# EAGLE board iotester (EAGLE 6.6.0)
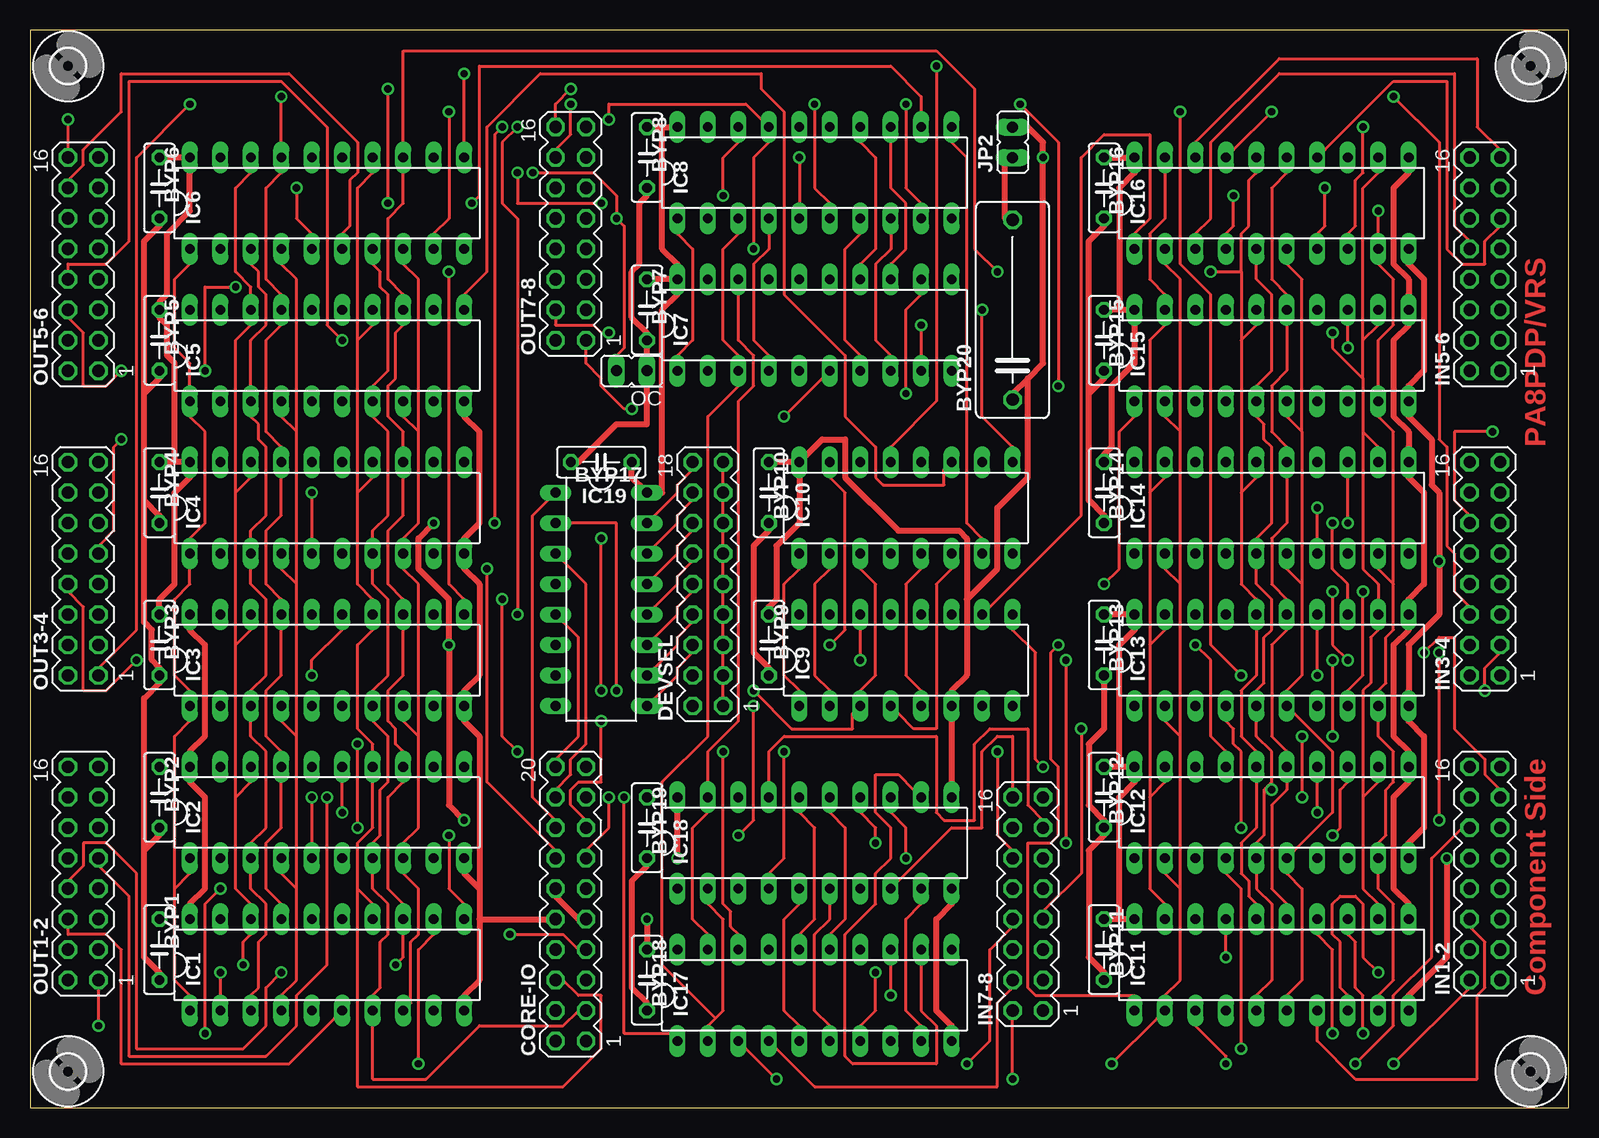
[diagram p2: board, top side]
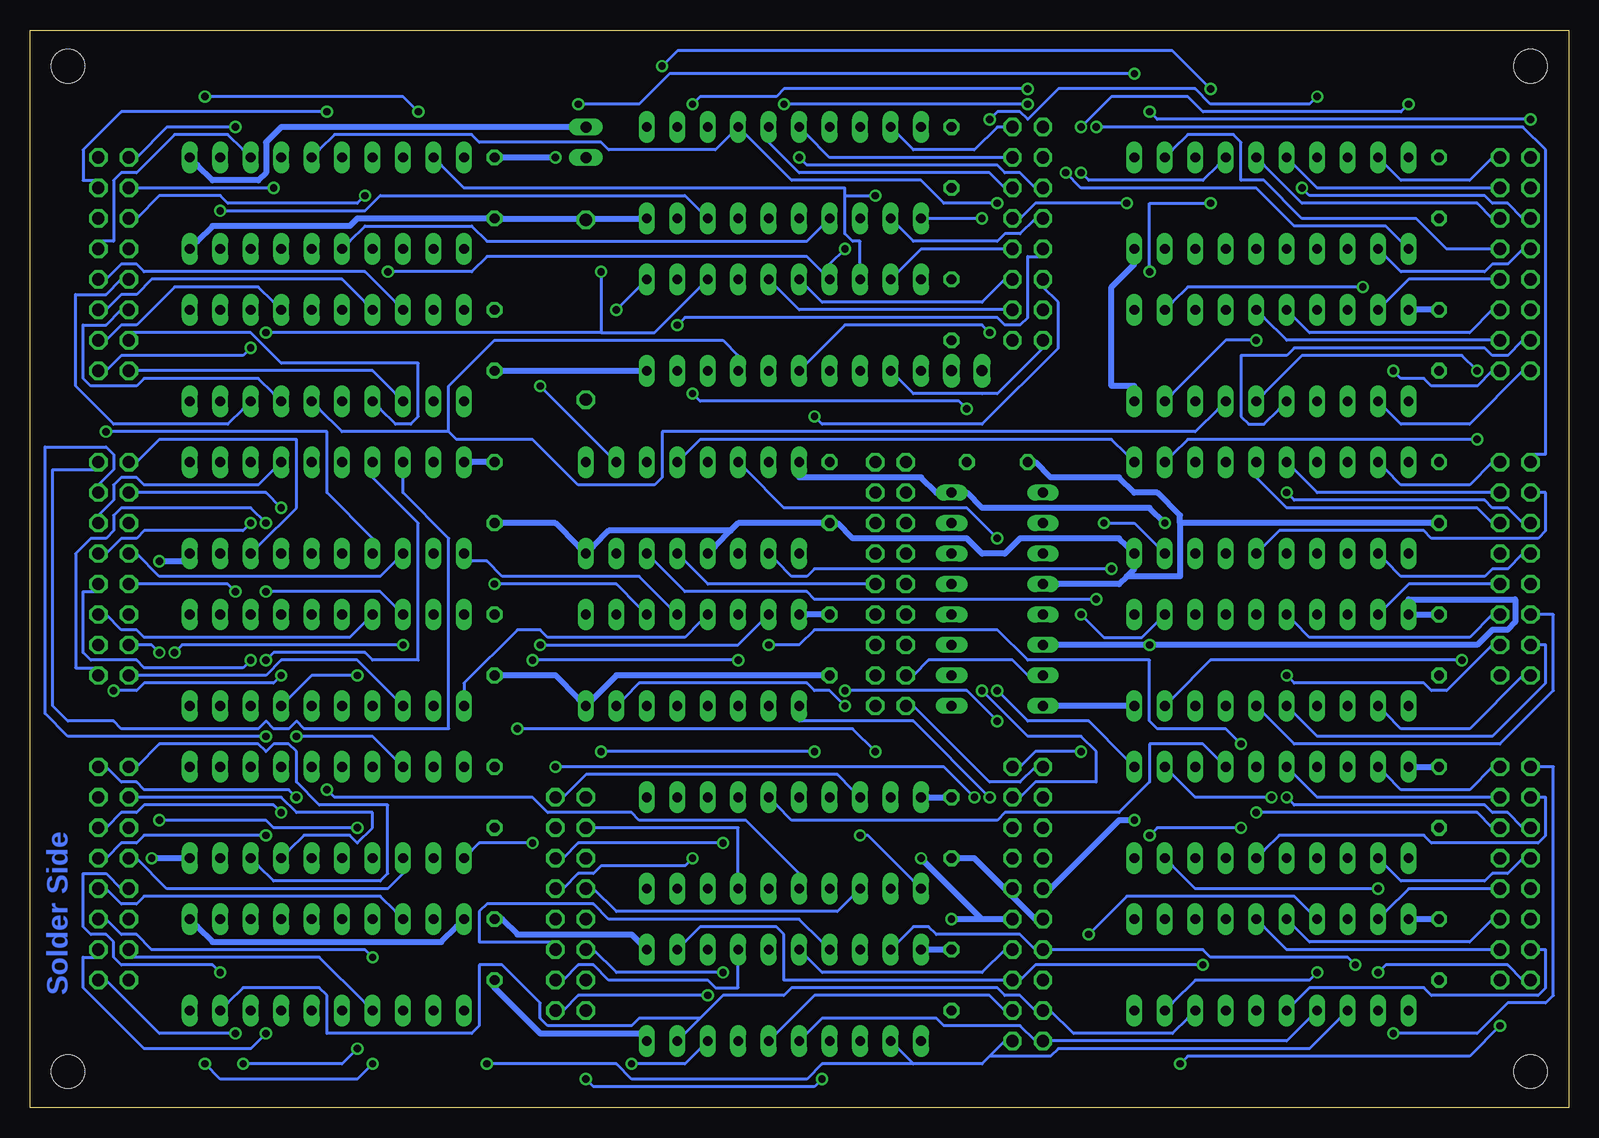
[diagram p3: board, bottom side, seen from below]

Size 128.25 x 89.84 mm. Coordinates in mm from the lower left corner, seen from the top.
Outline: 0,0 128.25,0 128.25,89.84 0,89.84 0,0
Copper layers (1*16): Top 0.035mm / dielectric 1.5mm / Bottom 0.035mm
Design rules "olimex10mil": minimum track width 10mil, minimum drill 24mil, track to track 10mil, track to pad 10mil, pad to pad 10mil, via to via 10mil, smd to smd 10mil, copper to edge 40mil, drill to drill 10mil, minimum pad ring 10mil, minimum via ring 8mil, stop-mask expansion 0mil, vias tented up to drill 0mil, thermal gap 10mil
Net classes: 1 Power: width 0.508 mm, drill 0.254 mm, clearance 0.254 mm

## Footprints (pad centres in the part's own frame; a part is rotated, then mirrored left to right if it is on the bottom)
JP1 = drill 0.914 long: 1 0,-1.27; 2 0,1.27
C050-025X075 = drill 0.813 octagon: 1 -2.54,0; 2 2.54,0
C150-064X183 = drill 1.016 octagon: 1 -7.493,0; 2 7.493,0
MA10-2 = drill 1.016 octagon: 1 -11.43,-1.27; 2 -11.43,1.27; 3 -8.89,-1.27; 4 -8.89,1.27; 5 -6.35,-1.27; 6 -6.35,1.27; 7 -3.81,-1.27; 8 -3.81,1.27; 9 -1.27,-1.27; 10 -1.27,1.27; 11 1.27,-1.27; 12 1.27,1.27; 13 3.81,-1.27; 14 3.81,1.27; 15 6.35,-1.27; 16 6.35,1.27; 17 8.89,-1.27; 18 8.89,1.27; 19 11.43,-1.27; 20 11.43,1.27
MA09-2 = drill 1.016 octagon: 1 -10.16,-1.27; 2 -10.16,1.27; 3 -7.62,-1.27; 4 -7.62,1.27; 5 -5.08,-1.27; 6 -5.08,1.27; 7 -2.54,-1.27; 8 -2.54,1.27; 9 0,-1.27; 10 0,1.27; 11 2.54,-1.27; 12 2.54,1.27; 13 5.08,-1.27; 14 5.08,1.27; 15 7.62,-1.27; 16 7.62,1.27; 17 10.16,-1.27; 18 10.16,1.27
DIL20 = drill 0.813 long: 1 -11.43,-3.81; 2 -8.89,-3.81; 3 -6.35,-3.81; 4 -3.81,-3.81; 5 -1.27,-3.81; 6 1.27,-3.81; 7 3.81,-3.81; 8 6.35,-3.81; 9 8.89,-3.81; 10 11.43,-3.81; 11 11.43,3.81; 12 8.89,3.81; 13 6.35,3.81; 14 3.81,3.81; 15 1.27,3.81; 16 -1.27,3.81; 17 -3.81,3.81; 18 -6.35,3.81; 19 -8.89,3.81; 20 -11.43,3.81
DIL16 = drill 0.813 long: 1 -8.89,-3.81; 2 -6.35,-3.81; 3 -3.81,-3.81; 4 -1.27,-3.81; 5 1.27,-3.81; 6 3.81,-3.81; 7 6.35,-3.81; 8 8.89,-3.81; 9 8.89,3.81; 10 6.35,3.81; 11 3.81,3.81; 12 1.27,3.81; 13 -1.27,3.81; 14 -3.81,3.81; 15 -6.35,3.81; 16 -8.89,3.81
MA08-2 = drill 1.016 octagon: 1 -8.89,-1.27; 2 -8.89,1.27; 3 -6.35,-1.27; 4 -6.35,1.27; 5 -3.81,-1.27; 6 -3.81,1.27; 7 -1.27,-1.27; 8 -1.27,1.27; 9 1.27,-1.27; 10 1.27,1.27; 11 3.81,-1.27; 12 3.81,1.27; 13 6.35,-1.27; 14 6.35,1.27; 15 8.89,-1.27; 16 8.89,1.27
2,8 = hole 2.8: 0,0

## Placement (x,y rotation side)
!OC  POWER  [JP1]  50.16,61.43 90 top
BYP1  0.1uf  [C050-025X075]  10.79,13.17 270 top
BYP2  0.1uf  [C050-025X075]  10.79,25.87 270 top
BYP3  0.1uf  [C050-025X075]  10.79,38.57 270 top
BYP4  0.1uf  [C050-025X075]  10.79,51.27 270 top
BYP5  0.1uf  [C050-025X075]  10.79,63.97 270 top
BYP6  0.1uf  [C050-025X075]  10.79,76.67 270 top
BYP7  0.1uf  [C050-025X075]  51.43,66.51 270 top
BYP8  0.1uf  [C050-025X075]  51.43,79.21 270 top
BYP9  0.1uf  [C050-025X075]  61.59,38.57 270 top
BYP10  0.1uf  [C050-025X075]  61.59,51.27 270 top
BYP11  0.1uf  [C050-025X075]  89.53,13.17 270 top
BYP12  0.1uf  [C050-025X075]  89.53,25.87 270 top
BYP13  0.1uf  [C050-025X075]  89.53,38.57 270 top
BYP14  0.1uf  [C050-025X075]  89.53,51.27 270 top
BYP15  0.1uf  [C050-025X075]  89.53,63.97 270 top
BYP16  0.1uf  [C050-025X075]  89.53,76.67 270 top
BYP17  0.1uf  [C050-025X075]  47.62,53.81 180 top
BYP18  0.1uf  [C050-025X075]  51.43,10.63 270 top
BYP19  0.1uf  [C050-025X075]  51.43,23.33 270 top
BYP20  100uf 25V  [C150-064X183]  81.91,66.51 90 top
CORE-IO  [MA10-2]  45.08,16.98 90 top
DEVSEL  [MA09-2]  56.51,43.65 90 top
IC1  374N  [DIL20]  24.76,11.9 0 top
IC2  374N  [DIL20]  24.76,24.6 0 top
IC3  374N  [DIL20]  24.76,37.3 0 top
IC4  374N  [DIL20]  24.76,50 0 top
IC5  374N  [DIL20]  24.76,62.7 0 top
IC6  374N  [DIL20]  24.76,75.4 0 top
IC7  374N  [DIL20]  65.4,65.24 0 top
IC8  374N  [DIL20]  65.4,77.94 0 top
IC9  138N  [DIL16]  73.02,37.3 0 top
IC10  138N  [DIL16]  73.02,50 0 top
IC11  373N  [DIL20]  103.5,11.9 0 top
IC12  373N  [DIL20]  103.5,24.6 0 top
IC13  373N  [DIL20]  103.5,37.3 0 top
IC14  373N  [DIL20]  103.5,50 0 top
IC15  373N  [DIL20]  103.5,62.7 0 top
IC16  373N  [DIL20]  103.5,75.4 0 top
IC17  373N  [DIL20]  65.4,9.36 0 top
IC18  373N  [DIL20]  65.4,22.06 0 top
IC19  138N  [DIL16]  47.62,42.38 270 top
IN1-2  [MA08-2]  121.28,19.52 90 top
IN3-4  [MA08-2]  121.28,44.92 90 top
IN5-6  [MA08-2]  121.28,70.32 90 top
IN7-8  [MA08-2]  83.18,16.98 90 top
JP2  POWER  [JP1]  81.91,80.48 0 top
OUT1-2  [MA08-2]  4.44,19.52 90 top
OUT3-4  [MA08-2]  4.44,44.92 90 top
OUT5-6  [MA08-2]  4.44,70.32 90 top
OUT7-8  [MA08-2]  45.08,72.86 90 top
U$1  [2,8]  125.09,3.01 0 top
U$2  [2,8]  125.09,86.83 0 top
U$3  [2,8]  3.17,86.83 0 top
U$4  [2,8]  3.17,3.01 0 top

## Tracks (layer width: path | path; a pad name or v marks a point on that pad's centre or on a via)
!OC  (via drill 0.61)
  Top 0.254: 12.06,18.25 12.06,10.63 13.33,9.36 IC1.1 | 12.06,18.25 13.33,19.52 IC2.1 | 12.06,18.25 12.06,30.95 13.33,32.22 IC3.1 13.33,34.76 12.06,36.03 12.06,42.38 13.33,43.65 13.33,44.92 IC4.1 13.33,47.46 14.6,48.73 14.6,56.35 13.33,57.62 IC5.1 13.33,60.16 13.33,62.06 12.06,63.34 12.06,69.05 13.33,70.32 IC6.1 | IC7.1 53.97,62.7 55.24,63.97 55.24,71.59 53.97,72.86 IC8.1 | v41.91,77.94 46.98,77.94 48.89,76.03 v48.89,74.13 49.53,73.5 49.53,63.34 48.89,62.7 !OC.2
  Bottom 0.254: v48.89,74.13 53.34,74.13 IC8.1 | v41.91,77.94 40.64,76.67 26.03,76.67 22.86,73.5 15.24,73.5 13.97,72.22 IC6.1
GND  (via drill 0.61)
  Top 0.508: 9.52,21.42 9.52,12.54 10.79,11.27 BYP1.2 | 9.52,21.42 10.79,22.7 BYP2.2 | 9.52,21.42 9.52,34.12 10.79,35.39 BYP3.2 10.79,36.66 10.16,37.3 10.16,39.84 9.52,40.48 9.52,50.63 | 9.52,50.63 10.79,49.37 BYP4.2 | 9.52,50.63 9.52,59.52 | 9.52,59.52 10.79,60.8 BYP5.2 | 9.52,59.52 9.52,72.22 10.79,73.5 BYP6.2 | BYP18.2 51.43,8.73 50.16,10 50.16,18.88 51.43,20.15 BYP19.2 | 37.46,18.25 37.46,15.71 | 37.46,15.71 37.46,10.63 36.19,9.36 IC1.10 | 37.46,18.25 36.19,19.52 IC2.10 | 37.46,18.25 37.46,30.95 36.19,32.22 IC3.10 36.19,34.76 37.46,36.03 37.46,43.65 36.19,44.92 IC4.10 36.19,47.46 37.46,48.73 37.46,56.35 36.19,57.62 IC5.10 | 37.46,15.71 43.18,15.71 CORE-IO.10 | 51.43,60.16 51.43,56.98 48.89,56.98 45.72,53.81 BYP17.2 | 51.43,60.16 !OC.1 | !OC.1 51.43,63.34 BYP7.2 51.43,64.61 50.16,65.88 50.16,69.69 50.8,70.32 50.8,75.4 51.43,76.03 BYP8.2 | IC16.10 114.93,70.32 116.2,69.05 116.2,61.43 114.93,60.16 IC15.10 114.93,57.62 116.83,55.71 116.83,51.91 117.47,51.27 v117.47,45.55 117.47,41.11 114.93,38.57 114.93,34.76 IC13.10 114.93,32.22 116.2,30.95 116.2,23.33 114.93,22.06 IC12.10 | v118.1,20.79 118.1,12.54 114.93,9.36 IC11.10 | IC17.10 76.83,6.82 75.56,8.09 75.56,15.71 76.83,16.98 IC18.10 | BYP11.2 89.53,11.27 88.26,12.54 88.26,21.42 89.53,22.7 BYP12.2 89.53,23.96 88.26,25.23 88.26,30.31 89.53,31.58 89.53,35.39 BYP13.2 | JP2.1 81.27,78.58 81.27,74.13 BYP20.2 | BYP9.2 61.59,36.66 60.32,37.94 60.32,46.82 61.59,48.09 BYP10.2 | 88.26,59.52 89.53,60.8 BYP15.2 | 88.26,59.52 88.26,50.63 89.53,49.37 BYP14.2 | 88.26,59.52 88.26,72.22 89.53,73.5 BYP16.2 | 51.43,60.16 !OC.1
  Bottom 0.508: CORE-IO.10 44.45,15.71 46.35,17.61 CORE-IO.11 46.98,18.25 49.53,20.79 50.8,20.79 BYP19.2 | IC3.10 36.83,33.49 42.54,33.49 IC19.8 | 36.83,44.28 37.46,43.65 42.54,43.65 IC19.4 | 36.83,44.28 36.19,44.92 IC4.10 36.83,46.82 37.46,47.46 45.72,47.46 46.98,46.19 48.89,46.19 50.16,47.46 59.69,47.46 60.96,48.73 BYP10.2 62.23,48.73 69.21,48.73 69.84,48.09 | IC6.10 36.19,70.32 38.1,68.41 38.1,60.16 36.19,60.16 IC5.10 | 32.38,48.73 32.38,44.28 36.83,44.28 | 32.38,48.73 32.38,49.37 34.29,51.27 36.19,51.27 37.46,52.54 43.18,52.54 44.45,53.81 BYP17.2 | 32.38,48.73 11.43,48.73 BYP4.2 | v118.1,20.79 115.56,20.79 IC12.10 | v117.47,45.55 115.56,45.55 IC14.10 | BYP11.2 89.53,10 85.72,6.18 77.46,6.18 IC17.10 | IC8.10 77.46,74.13 81.27,74.13 BYP20.2 82.55,74.13 88.89,74.13 BYP16.2 90.16,74.13 100.96,74.13 101.59,73.5 113.02,73.5 114.3,72.22 IC16.10 | IC7.10 77.46,61.43 88.89,61.43 BYP15.2 | BYP14.2 88.89,48.73 84.45,48.73 82.55,46.82 IC10.8 81.27,46.82 80,48.09 69.84,48.09 | BYP13.2 88.89,36.03 84.45,36.03 82.55,34.12 IC9.8 81.27,34.12 79.37,36.03 62.23,36.03 BYP9.2 | 69.84,48.09 71.11,46.82 IC10.4
IN00  (via drill 0.61)
  Top 0.254: v85.72,38.57 85.08,37.94 85.08,29.04 85.72,28.41 85.72,22.7 85.08,22.06 83.18,22.06 83.18,10 83.81,9.36 92.07,9.36 IC11.1
  Bottom 0.254: v85.72,38.57 69.21,38.57 67.3,40.48 IC9.15
IN01  (via drill 0.61)
  Top 0.254: v86.35,37.3 v86.35,22.06 | v69.21,37.3 69.21,39.84 IC9.14
  Bottom 0.254: v86.35,22.06 90.8,22.06 91.44,21.42 IC12.1 | v69.21,37.3 v86.35,37.3
IN02
  Bottom 0.254: IC9.13 72.38,40.48 73.66,39.2 85.08,39.2 85.72,39.84 87.62,39.84 92.07,35.39 92.07,34.76 IC13.1
IN03
  Bottom 0.254: IC9.12 74.92,41.74 77.46,44.28 88.89,44.28 90.16,45.55 91.44,45.55 IC14.1
IN04  (via drill 0.61)
  Top 0.254: v89.53,43.65 90.8,44.92 90.8,56.35 92.07,57.62 IC15.1
  Bottom 0.254: v89.53,43.65 79.37,43.65 77.46,41.74 IC9.11
IN05
  Top 0.254: IC9.10 80,41.74 87.62,49.37 87.62,79.21 89.53,81.11 93.34,81.11 93.34,74.13 92.07,72.86 IC16.1
IN06  (via drill 0.61)
  Top 0.254: v49.53,25.87 49.53,6.18 53.34,6.18 IC17.1 | v84.45,28.41 83.81,29.04 83.81,37.94 81.91,39.84 IC9.9
  Bottom 0.254: v49.53,25.87 52.07,28.41 v84.45,28.41
IN07  (via drill 0.61)
  Top 0.254: v59.05,22.7 60.32,23.96 v60.32,33.49
  Bottom 0.254: v59.05,22.7 58.41,22.7 54.61,18.88 IC18.1 | v60.32,33.49 61.59,34.76 62.86,34.76 63.5,35.39 77.46,35.39 78.73,34.12 IC9.7
N$1
  Bottom 0.254: IC12.3 97.15,19.52 98.42,18.25 116.83,18.25 119.38,20.79 IN1-2.10
N$2  (via drill 0.61)
  Top 0.254: v100.96,4.92 100.96,18.25 99.69,19.52 IC12.4 | v110.48,3.64 113.66,6.82 113.66,9.36 116.83,12.54 116.83,20.79 119.38,23.33 IN1-2.12
  Bottom 0.254: v100.96,4.92 102.23,3.64 v110.48,3.64
N$3
  Top 0.254: IC19.15 52.07,49.37 53.97,51.27 53.97,51.91 55.24,53.17 DEVSEL.18
N$4
  Top 0.254: IC19.14 52.07,46.82 53.97,48.73 53.97,49.37 55.24,50.63 DEVSEL.16
N$5
  Top 0.254: IC19.13 52.07,44.28 53.97,46.19 53.97,46.82 55.24,48.09 DEVSEL.14
N$6
  Top 0.254: IC19.12 52.07,41.74 53.97,43.65 53.97,44.28 55.24,45.55 DEVSEL.12
N$7
  Bottom 0.254: IC12.7 106.67,21.42 105.41,22.7 101.59,22.7 100.96,22.06 99.69,23.33 99.69,24.6 106.04,24.6 107.31,25.87 119.38,25.87 IN1-2.14
N$8
  Bottom 0.254: IC12.8 109.21,20.15 107.94,18.88 99.05,18.88 98.42,19.52 98.42,25.23 104.13,25.23 106.04,27.14 106.04,29.68 106.67,30.31 107.94,30.31 108.58,29.68 109.21,30.31 117.47,30.31 119.38,28.41 IN1-2.16
N$9  (via drill 0.61)
  Top 0.254: v112.39,11.27 111.12,12.54 111.12,16.98 110.48,17.61 109.21,17.61 108.58,16.98 108.58,14.44 109.21,13.81 109.21,10 109.85,9.36 IC11.8
  Bottom 0.254: v112.39,11.27 113.02,11.9 120.64,11.9 121.28,12.54 121.28,13.81 121.91,14.44 123.19,14.44 123.82,15.08 123.82,19.52 121.91,19.52 120.64,18.25 IN1-2.8
N$10
  Top 0.254: IC11.7 107.31,6.82 107.31,5.55 110.48,2.38 120.64,2.38 120.64,9.36 121.28,10 121.28,13.81 120.01,15.08 IN1-2.6
N$11
  Bottom 0.254: IC11.4 100.32,8.73 104.13,12.54 120.01,12.54 IN1-2.4
N$12  (via drill 0.61)
  Top 0.254: v99.69,3.64 99.69,4.28 97.15,6.82 IC11.3 | v113.66,3.64 120.01,10 IN1-2.2
  Bottom 0.254: v99.69,3.64 100.96,2.38 112.39,2.38 v113.66,3.64
N$13  (via drill 0.61)
  Top 0.254: v111.12,6.18 111.12,9.36 110.48,10 110.48,13.81 109.85,14.44 IC11.13
  Bottom 0.254: v111.12,6.18 117.47,6.18 121.91,10.63 IN1-2.1
N$14  (via drill 0.61)
  Top 0.254: v108.58,6.18 108.58,13.17 107.31,14.44 IC11.14
  Bottom 0.254: v108.58,6.18 109.85,4.92 118.74,4.92 123.82,10 123.82,12.54 122.55,12.54 IN1-2.3
N$15  (via drill 0.61)
  Top 0.254: v99.69,12.54 99.69,14.44 IC11.17
  Bottom 0.254: v99.69,12.54 100.32,13.17 118.1,13.17 119.38,14.44 120.64,14.44 121.91,15.71 IN1-2.5
N$16
  Bottom 0.254: IC11.18 97.78,16.34 99.05,17.61 118.74,17.61 119.38,16.98 120.64,16.98 121.91,18.25 IN1-2.7
N$17  (via drill 0.61)
  Top 0.254: v108.58,22.7 109.21,23.33 109.21,26.5 109.85,27.14 IC12.13
  Bottom 0.254: v108.58,22.7 118.74,22.7 119.38,22.06 120.64,22.06 121.91,20.79 IN1-2.9
N$18  (via drill 0.61)
  Top 0.254: v107.31,24.6 107.31,27.14 IC12.14
  Bottom 0.254: v107.31,24.6 107.94,25.23 118.74,25.23 119.38,24.6 120.64,24.6 121.91,23.33 IN1-2.11
N$19  (via drill 0.61)
  Top 0.254: v97.15,38.57 98.42,37.3 98.42,30.95 99.69,29.68 IC12.17 | v116.2,37.94 117.47,39.2 118.74,39.2 118.74,31.58 121.28,29.04 121.28,27.77 122.55,26.5 IN1-2.13
  Bottom 0.254: v97.15,38.57 115.56,38.57 v116.2,37.94
N$20  (via drill 0.61)
  Top 0.254: v106.04,30.95 v106.04,25.87
  Bottom 0.254: v106.04,30.95 99.69,30.95 97.78,29.04 IC12.18 | v106.04,25.87 106.67,26.5 118.74,26.5 119.38,27.14 120.64,27.14 121.91,28.41 IN1-2.15
N$21
  Top 0.254: IC19.11 52.07,39.2 53.97,41.11 53.97,41.74 55.24,43.02 DEVSEL.10
N$22
  Top 0.254: IC19.10 52.07,36.66 53.97,38.57 53.97,39.2 55.24,40.48 DEVSEL.8
N$23
  Top 0.254: IC19.9 52.07,34.12 53.97,36.03 53.97,36.66 55.24,37.94 DEVSEL.6
N$24
  Bottom 0.254: IC19.7 45.08,36.03 46.35,37.3 53.34,37.3 54.61,36.03 DEVSEL.4
N$25
  Top 0.254: IC9.5 74.29,34.76 73.02,36.03 73.02,43.65 74.29,44.92 IC10.5 | DEVSEL.1 57.78,34.12 57.78,35.39 DEVSEL.3 57.78,36.66 57.78,37.94 DEVSEL.5 57.78,39.2 57.78,40.48 DEVSEL.7 57.78,41.74 57.78,43.02 DEVSEL.9 57.78,44.28 57.78,45.55 DEVSEL.11 57.78,46.82 57.78,48.09 DEVSEL.13 57.78,49.37 57.78,50.63 DEVSEL.15 57.78,51.91 57.78,53.17 DEVSEL.17
  Bottom 0.254: IC10.5 73.66,45.55 71.75,43.65 58.41,43.65 DEVSEL.9
N$26
  Bottom 0.254: IC5.2 15.24,58.25 13.97,56.98 8.25,56.98 3.8,61.43 OUT5-6.2
N$27
  Top 0.254: IC18.8 72.38,18.88 76.83,23.33 79.37,23.33 79.37,29.68 80.64,30.95 81.91,30.95 81.91,26.5 IN7-8.16
N$28
  Bottom 0.254: IC18.3 59.69,17.61 60.96,16.34 79.37,16.34 81.27,18.25 IN7-8.10
N$29
  Bottom 0.254: IC14.3 97.78,45.55 99.05,44.28 117.47,44.28 119.38,46.19 IN3-4.10
N$30  (via drill 0.61)
  Top 0.254: v121.91,56.35 118.74,56.35 118.74,50.63 120.01,49.37 IN3-4.12
  Bottom 0.254: v121.91,56.35 103.5,56.35 103.5,51.27 99.69,47.46 IC14.4
N$31  (via drill 0.61)
  Top 0.254: v107.31,50 107.31,47.46 IC14.7
  Bottom 0.254: v107.31,50 108.58,51.27 119.38,51.27 IN3-4.14
N$32
  Bottom 0.254: IC14.8 109.21,46.82 106.04,50 106.04,55.71 117.47,55.71 119.38,53.81 IN3-4.16
N$33  (via drill 0.61)
  Top 0.254: v40.64,41.11 40.64,74.13 39.37,75.4 39.37,80.48 v40.64,81.75 | v13.33,83.66 8.89,79.21 8.89,39.84 5.71,36.66 OUT3-4.1
  Bottom 0.254: v40.64,41.11 38.73,39.2 35.55,39.2 34.29,40.48 IC3.12 | v40.64,81.75 38.1,84.29 31.74,84.29 30.47,83.02 13.97,83.02 v13.33,83.66
N$34  (via drill 0.61)
  Top 0.254: v23.49,36.03 23.49,37.3 26.03,39.84 IC3.15
  Bottom 0.254: v23.49,36.03 22.86,35.39 12.06,35.39 11.43,34.76 10.16,34.76 6.34,38.57 OUT3-4.3
N$35
  Bottom 0.254: IC3.16 22.86,40.48 21.58,39.2 8.25,39.2 6.34,41.11 OUT3-4.5
N$36
  Bottom 0.254: IC3.19 15.24,41.74 13.33,43.65 6.34,43.65 OUT3-4.7
N$37
  Bottom 0.254: IC13.3 97.78,34.12 100.96,37.3 107.31,37.3 108.58,36.03 119.38,36.03 IN3-4.2
N$38  (via drill 0.61)
  Top 0.254: v100.96,23.33 100.96,29.68 100.32,30.31 100.32,31.58 99.69,32.22 IC13.4 | v117.47,23.96 v117.47,37.94
  Bottom 0.254: v100.96,23.33 107.94,23.33 108.58,23.96 v117.47,23.96 | v117.47,37.94 118.1,38.57 119.38,38.57 IN3-4.4
N$39  (via drill 0.61)
  Top 0.254: v100.96,36.03 98.42,38.57 98.42,67.78 95.88,70.32 v95.88,83.02 | v113.66,84.29 117.47,80.48 117.47,55.71 118.1,55.08 118.1,46.82 118.74,46.19 118.74,43.02 120.01,41.74 IN3-4.6
  Bottom 0.254: v100.96,36.03 104.77,36.03 106.67,34.12 IC13.7 | v95.88,83.02 97.15,84.29 v113.66,84.29
N$40  (via drill 0.61)
  Top 0.254: v111.12,43.02 111.12,36.03 109.85,34.76 IC13.8
  Bottom 0.254: v111.12,43.02 111.75,43.65 119.38,43.65 IN3-4.8
N$41  (via drill 0.61)
  Top 0.254: v109.85,48.73 109.85,52.54 IC14.13
  Bottom 0.254: v109.85,48.73 110.48,48.09 118.74,48.09 119.38,47.46 120.64,47.46 121.91,46.19 IN3-4.9
N$42
  Bottom 0.254: IC14.14 107.94,53.17 109.21,51.91 118.74,51.91 119.38,52.54 120.64,52.54 121.28,51.91 121.28,50.63 122.55,49.37 IN3-4.11
N$43  (via drill 0.61)
  Top 0.254: v108.58,37.3 v108.58,30.95
  Bottom 0.254: v108.58,37.3 107.94,37.94 100.32,37.94 99.69,37.3 95.88,37.3 95.88,48.73 99.69,52.54 IC14.17 | v108.58,30.95 125.09,30.95 126.99,32.85 126.99,55.08 121.91,55.08 121.28,54.45 121.28,53.17 122.55,51.91 IN3-4.13
N$44
  Bottom 0.254: IC14.18 97.15,52.54 97.15,51.27 93.34,47.46 93.34,31.58 105.41,31.58 106.04,32.22 106.67,31.58 107.94,31.58 108.58,32.22 109.21,31.58 120.64,31.58 121.28,32.22 125.09,32.22 126.36,33.49 126.36,53.17 122.55,53.17 IN3-4.15
N$45  (via drill 0.61)
  Top 0.254: v108.58,48.73 108.58,44.92 109.85,43.65 109.85,42.38 IC13.13
  Bottom 0.254: v108.58,48.73 109.85,50 120.64,50 121.28,49.37 121.28,48.09 121.91,47.46 123.19,47.46 124.45,46.19 124.45,36.66 122.55,36.66 IN3-4.1
N$46  (via drill 0.61)
  Top 0.254: v107.31,36.03 107.31,39.84 IC13.14 | v121.28,34.76 121.28,36.66 122.55,37.94 IN3-4.3
  Bottom 0.254: v107.31,36.03 107.94,35.39 118.74,35.39 119.38,34.76 v121.28,34.76
N$47
  Bottom 0.254: IC13.17 100.32,40.48 101.59,39.2 118.74,39.2 119.38,39.84 120.64,39.84 121.91,41.11 IN3-4.5
N$48  (via drill 0.61)
  Top 0.254: v108.58,43.02 108.58,38.57 v109.85,37.3
  Bottom 0.254: v108.58,43.02 99.05,43.02 97.78,41.74 IC13.18 | v109.85,37.3 110.48,36.66 118.74,36.66 119.38,37.3 123.19,37.3 123.82,37.94 123.82,43.02 122.55,43.02 IN3-4.7
N$49
  Bottom 0.254: IC3.5 22.86,32.85 20.95,30.95 6.34,30.95 1.9,35.39 1.9,38.57 2.54,38.57 OUT3-4.4
N$50
  Bottom 0.254: IC3.6 25.39,32.85 22.86,30.31 5.71,30.31 1.27,34.76 1.27,41.11 2.54,41.11 OUT3-4.6
N$51
  Bottom 0.254: IC3.2 15.24,32.85 13.97,31.58 8.25,31.58 3.8,36.03 OUT3-4.2
N$52  (via drill 0.61)
  Top 0.254: v8.89,37.3 6.34,34.76 4.44,34.76 4.44,41.74 3.17,43.02 OUT3-4.8
  Bottom 0.254: v8.89,37.3 29.84,37.3 33.02,34.12 IC3.9
N$53  (via drill 0.61)
  Top 0.254: v32.38,3.64 32.38,13.17 33.65,14.44 IC1.12 | v5.71,6.82 5.71,10 OUT1-2.1
  Bottom 0.254: v32.38,3.64 31.74,4.28 8.25,4.28 v5.71,6.82
N$54
  Bottom 0.254: IC1.15 25.39,15.08 23.49,13.17 6.34,13.17 OUT1-2.3
N$55
  Bottom 0.254: IC1.16 22.86,15.08 21.58,13.81 8.25,13.81 6.34,15.71 OUT1-2.5
N$56
  Bottom 0.254: IC1.19 15.24,16.34 13.33,18.25 6.34,18.25 OUT1-2.7
N$57  (via drill 0.61)
  Top 0.254: v15.87,11.27 15.87,9.36 IC1.2
  Bottom 0.254: v15.87,11.27 15.24,11.9 5.08,11.9 3.8,10.63 OUT1-2.2
N$58
  Bottom 0.254: IC1.5 22.86,8.73 21.58,10 12.06,10 11.43,9.36 2.54,9.36 1.9,10 1.9,13.17 2.54,13.17 OUT1-2.4
N$59
  Top 0.254: IC1.6 25.39,7.46 21.58,3.64 7.62,3.64 7.62,13.17 6.34,14.44 3.17,14.44 3.17,15.08 OUT1-2.6
N$60  (via drill 0.61)
  Top 0.254: v20.95,11.27 19.68,10 19.68,6.82 17.77,4.92 8.89,4.92 8.89,19.52 6.34,22.06 4.44,22.06 4.44,20.15 3.17,18.88 OUT1-2.8
  Bottom 0.254: v20.95,11.27 21.58,10.63 31.11,10.63 33.02,8.73 IC1.9
N$61
  Bottom 0.254: IC2.19 15.24,27.77 13.97,26.5 8.25,26.5 6.34,28.41 OUT1-2.15
N$62
  Bottom 0.254: IC2.16 22.86,27.77 20.95,25.87 6.34,25.87 OUT1-2.13
N$63  (via drill 0.61)
  Top 0.254: v26.03,24.6 26.03,27.14 IC2.15
  Bottom 0.254: v26.03,24.6 7.62,24.6 6.34,23.33 OUT1-2.11
N$64  (via drill 0.61)
  Top 0.254: v24.76,25.87 24.76,11.9 22.22,9.36 22.22,6.82 19.68,4.28 8.25,4.28 8.25,17.61 5.71,20.15 OUT1-2.9
  Bottom 0.254: v24.76,25.87 31.11,25.87 33.02,27.77 IC2.12
N$65
  Bottom 0.254: IC2.2 15.24,20.15 13.97,18.88 6.98,18.88 6.34,19.52 5.08,19.52 3.8,20.79 OUT1-2.10
N$66  (via drill 0.61)
  Top 0.254: v23.49,25.87 23.49,22.06 IC2.5
  Bottom 0.254: v23.49,25.87 22.86,25.23 6.98,25.23 6.34,24.6 5.08,24.6 3.8,23.33 OUT1-2.12
N$67
  Bottom 0.254: IC2.6 25.39,21.42 24.12,22.7 12.06,22.7 11.43,22.06 2.54,22.06 1.9,22.7 1.9,25.87 2.54,25.87 OUT1-2.14
N$68  (via drill 0.61)
  Top 0.254: v15.87,18.25 14.6,16.98 v14.6,6.18
  Bottom 0.254: v15.87,18.25 31.11,18.25 33.02,20.15 IC2.9 | v14.6,6.18 7.62,6.18 5.08,8.73 1.9,8.73 1.27,9.36 1.27,28.41 2.54,28.41 OUT1-2.16
N$69
  Bottom 0.254: IC4.2 15.24,45.55 13.97,44.28 6.98,44.28 6.34,44.92 5.08,44.92 3.8,46.19 OUT3-4.10
N$70  (via drill 0.61)
  Top 0.254: v23.49,51.27 23.49,47.46 IC4.5
  Bottom 0.254: v23.49,51.27 22.86,50.63 6.98,50.63 6.34,50 5.08,50 3.8,48.73 OUT3-4.12
N$71
  Bottom 0.254: IC4.6 25.39,46.82 24.12,48.09 12.06,48.09 11.43,47.46 2.54,47.46 1.9,48.09 1.9,51.27 2.54,51.27 OUT3-4.14
N$72  (via drill 0.61)
  Top 0.254: v38.73,48.73 38.73,81.11 v39.37,81.75
  Bottom 0.254: v38.73,48.73 36.19,48.73 34.29,46.82 IC4.9 | v39.37,81.75 3.8,81.75 1.9,79.84 1.9,54.45 3.17,54.45 OUT3-4.16
N$73
  Bottom 0.254: IC4.19 15.24,53.17 13.97,51.91 8.25,51.91 6.34,53.81 OUT3-4.15
N$74
  Bottom 0.254: IC4.16 22.86,53.17 20.95,51.27 6.34,51.27 OUT3-4.13
N$75
  Bottom 0.254: IC4.15 26.03,52.54 23.49,50 7.62,50 6.34,48.73 OUT3-4.11
N$76  (via drill 0.61)
  Top 0.254: v7.62,55.71 6.98,55.08 6.98,48.09 5.71,46.82 OUT3-4.9
  Bottom 0.254: v7.62,55.71 31.74,55.71 33.02,54.45 IC4.12
N$77
  Top 0.254: IC16.3 97.15,72.86 98.42,74.13 98.42,80.48 104.13,86.19 118.74,86.19 118.74,73.5 120.01,72.22 IN5-6.10
N$78  (via drill 0.61)
  Top 0.254: v100.32,76.03 100.32,73.5 99.69,72.86 IC16.4
  Bottom 0.254: v100.32,76.03 100.96,75.4 111.75,75.4 112.39,76.03 117.47,76.03 119.38,74.13 IN5-6.12
N$79  (via drill 0.61)
  Top 0.254: v107.94,76.67 107.94,73.5 107.31,72.86 IC16.7
  Bottom 0.254: v107.94,76.67 119.38,76.67 IN5-6.14
N$80  (via drill 0.61)
  Top 0.254: v111.12,81.75 111.12,77.94 110.48,77.3 110.48,73.5 109.85,72.86 IC16.8
  Bottom 0.254: v111.12,81.75 116.83,81.75 119.38,79.21 IN5-6.16
N$81  (via drill 0.61)
  Top 0.254: v17.14,68.41 14.6,68.41 v14.6,61.43
  Bottom 0.254: v17.14,68.41 31.74,68.41 33.02,67.14 IC5.12 | v14.6,61.43 13.97,60.8 12.06,60.8 11.43,60.16 7.62,60.16 6.34,61.43 OUT5-6.1
N$82
  Bottom 0.254: IC5.15 25.39,65.88 23.49,63.97 6.34,63.97 OUT5-6.3
N$83
  Bottom 0.254: IC5.16 22.86,65.88 21.58,64.61 8.25,64.61 6.34,66.51 OUT5-6.5
N$84
  Bottom 0.254: IC5.19 15.24,67.14 13.33,69.05 6.34,69.05 OUT5-6.7
N$85  (via drill 0.61)
  Top 0.254: v73.02,59.52 73.02,66.51 74.29,67.78 IC7.12 | OUT7-8.1 46.35,63.34 46.35,62.06 47.62,60.8 47.62,60.16 49.53,58.25 v50.16,58.25
  Bottom 0.254: v73.02,59.52 72.38,58.89 50.8,58.89 v50.16,58.25
N$86
  Bottom 0.254: IC7.15 66.03,68.41 64.13,66.51 46.98,66.51 OUT7-8.3
N$87
  Bottom 0.254: IC7.16 63.5,68.41 62.23,67.14 48.89,67.14 46.98,69.05 OUT7-8.5
N$88
  Bottom 0.254: IC7.19 55.88,69.69 53.97,71.59 46.98,71.59 OUT7-8.7
N$89
  Bottom 0.254: IC5.5 24.12,58.25 25.39,56.98 26.66,56.98 27.3,57.62 27.3,62.7 23.49,62.7 22.86,63.34 6.98,63.34 6.34,62.7 5.08,62.7 3.8,63.97 OUT5-6.4
N$90  (via drill 0.61)
  Top 0.254: v7.62,61.43 6.34,60.16 4.44,60.16 4.44,64.61 3.17,65.88 OUT5-6.6
  Bottom 0.254: v7.62,61.43 8.89,62.7 22.22,62.7 25.39,59.52 IC5.6
N$91  (via drill 0.61)
  Top 0.254: v26.03,63.97 24.76,65.24 24.76,81.75 20.95,85.56 8.25,85.56 8.25,72.22 6.34,70.32 3.17,70.32 3.17,69.69 OUT5-6.8
  Bottom 0.254: v26.03,63.97 28.57,63.97 33.02,59.52 IC5.9
N$92
  Bottom 0.254: IC6.12 33.02,79.84 31.74,81.11 27.93,81.11 27.3,80.48 27.3,77.3 25.39,77.3 22.22,74.13 12.7,74.13 10.16,71.59 6.34,71.59 OUT5-6.9
N$93
  Bottom 0.254: IC6.15 25.39,78.58 22.22,75.4 7.62,75.4 6.34,74.13 OUT5-6.11
N$94  (via drill 0.61)
  Top 0.254: v62.86,29.68 62.86,20.79 61.59,19.52 IC18.4 | v80.64,29.68 80.64,22.7 81.91,21.42 IN7-8.12
  Bottom 0.254: v62.86,29.68 v80.64,29.68
N$95
  Bottom 0.254: IC6.16 22.86,78.58 20.95,76.67 6.34,76.67 OUT5-6.13
N$96
  Bottom 0.254: IC6.19 15.24,78.58 13.97,77.3 8.25,77.3 6.34,79.21 OUT5-6.15
N$97
  Bottom 0.254: IC6.2 15.24,70.95 13.97,69.69 6.98,69.69 6.34,70.32 5.08,70.32 3.8,71.59 OUT5-6.10
N$98  (via drill 0.61)
  Top 0.254: v22.22,76.67 22.22,74.13 23.49,72.86 IC6.5
  Bottom 0.254: v22.22,76.67 21.58,76.03 6.98,76.03 6.34,75.4 5.08,75.4 3.8,74.13 OUT5-6.12
N$99
  Top 0.254: IC6.6 26.03,72.86 26.66,73.5 26.66,77.3 27.3,77.94 27.3,80.48 21.58,86.19 7.62,86.19 7.62,83.02 4.44,79.84 4.44,78.58 3.17,77.3 OUT5-6.14
N$100  (via drill 0.61)
  Top 0.254: v34.92,83.02 34.92,74.13 33.65,72.86 IC6.9 | v3.17,82.39 3.17,79.84 OUT5-6.16
  Bottom 0.254: v34.92,83.02 34.29,82.39 v3.17,82.39
N$101
  Bottom 0.254: IC15.3 97.78,59.52 99.69,61.43 119.38,61.43 IN5-6.2
N$102
  Bottom 0.254: IC15.4 99.05,58.25 97.78,56.98 96.52,56.98 95.88,57.62 95.88,62.06 107.31,62.06 109.85,64.61 120.01,64.61 IN5-6.4
N$103
  Bottom 0.254: IC15.7 107.94,59.52 109.21,60.8 118.74,60.8 119.38,60.16 123.19,60.16 123.82,60.8 123.82,65.24 121.91,65.24 120.64,66.51 IN5-6.6
N$104
  Bottom 0.254: IC15.8 110.48,58.25 111.75,56.98 121.28,56.98 124.45,60.16 124.45,67.78 121.91,67.78 120.64,69.05 IN5-6.8
N$105
  Bottom 0.254: IC16.13 110.48,79.84 111.75,81.11 116.2,81.11 119.38,77.94 120.64,77.94 121.28,77.3 121.28,72.22 122.55,72.22 IN5-6.9
N$106
  Top 0.254: IC16.14 107.94,79.84 113.66,85.56 118.1,85.56 118.1,71.59 119.38,70.32 121.28,70.32 121.28,72.22 122.55,73.5 IN5-6.11
N$107  (via drill 0.61)
  Top 0.254: v103.5,83.02 100.32,79.84 IC16.17
  Bottom 0.254: v103.5,83.02 120.64,83.02 123.82,79.84 123.82,77.3 122.55,77.3 IN5-6.13
N$108
  Top 0.254: IC16.18 97.15,80.48 104.13,87.47 120.64,87.47 120.64,81.75 122.55,79.84 IN5-6.15
N$109  (via drill 0.61)
  Top 0.254: v109.85,63.34 109.85,65.24 IC15.13
  Bottom 0.254: v109.85,63.34 110.48,62.7 120.64,62.7 121.91,61.43 IN5-6.1
N$110
  Bottom 0.254: IC15.14 107.94,67.14 109.21,68.41 116.2,68.41 119.38,65.24 120.64,65.24 121.91,63.97 IN5-6.3
N$111
  Bottom 0.254: IC15.17 100.32,67.14 102.23,69.05 118.1,69.05 119.38,67.78 120.64,67.78 121.91,66.51 IN5-6.5
N$112
  Bottom 0.254: IC15.18 97.78,67.14 100.32,69.69 118.74,69.69 119.38,70.32 120.64,70.32 121.91,69.05 IN5-6.7
N$113
  Bottom 0.254: IC8.19 55.88,81.11 54.61,79.84 49.53,79.84 47.62,81.75 46.98,81.75 OUT7-8.15
N$114
  Bottom 0.254: IC8.16 63.5,81.11 61.59,79.21 46.98,79.21 OUT7-8.13
N$115
  Bottom 0.254: IC8.15 66.67,80.48 64.13,77.94 48.26,77.94 46.98,76.67 OUT7-8.11
N$116  (via drill 0.61)
  Top 0.254: v36.83,75.4 37.46,76.03 37.46,86.83 71.75,86.83 74.29,84.29 74.29,83.02 IC8.12
  Bottom 0.254: v36.83,75.4 44.45,75.4 45.72,74.13 OUT7-8.9
N$117
  Bottom 0.254: IC8.2 55.88,73.5 54.61,72.22 47.62,72.22 46.98,72.86 45.72,72.86 44.45,74.13 OUT7-8.10
N$118  (via drill 0.61)
  Top 0.254: v64.13,79.21 64.13,75.4 IC8.5
  Bottom 0.254: v64.13,79.21 63.5,78.58 47.62,78.58 46.98,77.94 45.72,77.94 44.45,76.67 OUT7-8.12
N$119  (via drill 0.61)
  Top 0.254: v65.4,83.66 65.4,76.67 66.67,75.4 IC8.6 | v45.08,83.66 45.08,81.11 43.81,79.84 OUT7-8.14
  Bottom 0.254: v45.08,83.66 v65.4,83.66
N$120  (via drill 0.61)
  Top 0.254: v73.02,83.66 73.02,76.67 74.29,75.4 IC8.9 | v45.08,84.92 43.81,83.66 43.81,82.39 OUT7-8.16
  Bottom 0.254: v73.02,83.66 72.38,84.29 66.03,84.29 65.4,84.92 v45.08,84.92
N$121  (via drill 0.61)
  Top 0.254: v74.29,65.24 74.29,62.7 IC7.9
  Bottom 0.254: v74.29,65.24 73.66,65.88 47.62,65.88 46.98,65.24 45.72,65.24 45.08,65.88 45.08,70.95 43.81,70.95 OUT7-8.8
N$122  (via drill 0.61)
  Top 0.254: v62.86,57.62 66.03,60.8 IC7.6
  Bottom 0.254: v62.86,57.62 62.23,56.98 48.89,56.98 42.54,63.34 42.54,67.14 43.81,68.41 OUT7-8.6
N$123  (via drill 0.61)
  Top 0.254: v48.26,64.61 47.62,64.61 46.98,65.24 43.81,65.24 43.81,65.88 OUT7-8.4
  Bottom 0.254: v48.26,64.61 48.89,65.24 60.32,65.24 63.5,62.06 IC7.5
N$124
  Bottom 0.254: IC18.7 69.21,19.52 69.21,23.33 81.27,23.33 IN7-8.14
N$125  (via drill 0.61)
  Top 0.254: v73.02,20.79 73.02,23.33 71.75,24.6 IC18.13
  Bottom 0.254: v73.02,20.79 73.66,20.15 80.64,20.15 81.27,19.52 82.55,19.52 83.81,18.25 IN7-8.9
N$126  (via drill 0.61)
  Top 0.254: v70.48,22.06 70.48,23.33 69.21,24.6 IC18.14
  Bottom 0.254: v70.48,22.06 82.55,22.06 83.81,20.79 IN7-8.11
N$127
  Top 0.254: IC18.17 61.59,27.14 61.59,29.68 62.86,30.95 75.56,30.95 75.56,24.6 76.19,23.96 78.73,23.96 78.73,30.31 80,31.58 83.18,31.58 83.18,25.23 84.45,23.96 IN7-8.13
N$128
  Bottom 0.254: IC18.18 59.69,26.5 60.96,27.77 81.91,27.77 83.81,25.87 IN7-8.15
N$129  (via drill 0.61)
  Top 0.254: v62.23,2.38 59.69,4.92 IC17.3 | v81.91,2.38 81.91,7.46 IN7-8.2
  Bottom 0.254: v62.23,2.38 62.86,1.74 81.27,1.74 v81.91,2.38
N$130
  Top 0.254: IC17.4 62.23,4.92 65.4,1.74 80.64,1.74 80.64,8.73 81.91,10 IN7-8.4
N$131  (via drill 0.61)
  Top 0.254: v70.48,11.27 70.48,8.09 69.21,6.82 IC17.7
  Bottom 0.254: v70.48,11.27 79.37,11.27 81.27,13.17 IN7-8.6
N$132  (via drill 0.61)
  Top 0.254: v78.1,3.64 80,5.55 80,13.17 81.91,15.08 IN7-8.8
  Bottom 0.254: v78.1,3.64 73.66,3.64 72.38,4.92 IC17.8
N$133  (via drill 0.61)
  Top 0.254: v71.75,9.36 71.75,11.9 IC17.13
  Bottom 0.254: v71.75,9.36 82.55,9.36 83.81,8.09 IN7-8.1
N$134
  Bottom 0.254: IC17.14 69.21,11.9 69.21,10 71.11,10 71.75,10.63 80,10.63 81.27,11.9 82.55,11.9 83.81,10.63 IN7-8.3
N$135
  Bottom 0.254: IC17.17 62.23,13.81 64.13,15.71 80,15.71 81.27,16.98 90.16,16.98 90.8,16.34 90.8,13.81 84.45,13.81 IN7-8.5
N$136  (via drill 0.61)
  Top 0.254: v57.78,29.68 57.78,16.98 58.41,16.34 58.41,15.08 59.05,14.44 IC17.18 | v87.62,31.58 87.62,19.52 84.45,16.34 IN7-8.7
  Bottom 0.254: v57.78,29.68 59.69,31.58 v87.62,31.58
N$137
  Bottom 0.254: IC7.2 55.88,60.8 54.61,59.52 48.89,59.52 47.62,59.52 43.81,63.34 OUT7-8.2 44.45,63.97
OUT00  (via drill 0.61)
  Top 0.254: v34.92,22.7 34.92,18.25 36.19,16.98 IC1.11 | v27.3,23.33 v27.3,30.31 | v66.67,38.57 67.94,39.84 67.94,51.27 66.67,52.54 IC10.15
  Bottom 0.254: v34.92,22.7 34.29,23.33 v27.3,23.33 | v27.3,30.31 28.57,31.58 34.29,31.58 34.92,32.22 34.92,37.3 45.08,37.3 47.62,39.84 62.86,39.84 64.13,38.57 v66.67,38.57
OUT01  (via drill 0.61)
  Top 0.254: v47.62,34.76 v47.62,47.46
  Bottom 0.254: v47.62,34.76 45.08,32.22 40,32.22 36.83,29.04 IC2.11 | v47.62,47.46 50.16,50 65.4,50 68.57,53.17 IC10.14
OUT02  (via drill 0.61)
  Top 0.254: v34.92,69.69 34.92,43.65 36.19,42.38 IC3.11 | v29.84,75.4 v29.84,84.92 | v75.56,86.83 75.56,58.89 71.75,55.08 IC10.13
  Bottom 0.254: v34.92,69.69 34.92,75.4 v29.84,75.4 | v29.84,84.92 33.02,88.1 74.29,88.1 v75.56,86.83
OUT03
  Bottom 0.254: IC4.11 36.83,54.45 38.1,55.71 72.38,55.71 73.66,54.45 IC10.12
OUT04
  Top 0.254: IC5.11 36.19,67.78 38.1,69.69 38.1,81.75 42.54,86.19 60.96,86.19 60.96,84.92 62.86,83.02 62.86,67.78 67.94,62.7 67.94,57.62 70.48,55.08 70.48,52.54 71.11,51.91 76.19,51.91 76.19,53.17 IC10.11
OUT05  (via drill 0.61)
  Top 0.254: v36.19,86.19 36.19,80.48 IC6.11 | v82.55,83.66 85.72,80.48 v85.72,60.16
  Bottom 0.254: v36.19,86.19 74.92,86.19 77.46,83.66 v82.55,83.66 | v85.72,60.16 80,54.45 IC10.10
OUT06  (via drill 0.61)
  Top 0.254: v79.37,66.51 79.37,57.62 81.91,55.08 IC10.9
  Bottom 0.254: v79.37,66.51 77.46,68.41 IC7.11
OUT07
  Top 0.254: IC10.7 79.37,47.46 78.1,48.73 78.1,79.21 76.83,80.48 IC8.11
PIA-A0  (via drill 0.61)
  Top 0.254: 95.88,18.25 95.88,10.63 94.61,9.36 IC11.2 93.97,7.46 v90.16,3.64 | 95.88,18.25 94.61,19.52 IC12.2 | 95.88,30.95 94.61,32.22 IC13.2 | 95.88,18.25 95.88,30.95 | 95.88,43.65 94.61,44.92 IC14.2 | 95.88,30.95 95.88,43.65 | 95.88,56.35 94.61,57.62 IC15.2 | 95.88,43.65 95.88,56.35 | 95.88,56.35 95.88,69.05 94.61,70.32 IC16.2 | IC1.3 18.41,9.36 19.04,10 19.04,13.81 19.68,14.44 19.68,16.98 18.41,18.25 18.41,19.52 IC2.3 18.41,22.06 19.68,23.33 19.68,29.68 18.41,30.95 18.41,32.22 IC3.3 18.41,34.76 19.68,36.03 19.68,42.38 18.41,43.65 18.41,44.92 IC4.3 18.41,47.46 18.41,48.09 19.68,49.37 19.68,55.08 19.04,55.71 19.04,56.98 18.41,57.62 IC5.3 18.41,60.16 18.41,63.97 19.68,65.24 19.68,67.78 19.04,68.41 19.04,69.69 18.41,70.32 IC6.3 | IC8.3 59.05,72.86 57.78,71.59 57.78,63.97 59.05,62.7 IC7.3 59.05,60.16 56.51,57.62 56.51,30.95 52.7,27.14 52.7,11.9 57.15,7.46 | 57.15,7.46 56.51,6.82 IC17.2 | 57.15,7.46 57.78,8.09 57.78,15.71 56.51,16.98 IC18.2
  Bottom 0.254: 54.61,3.64 55.88,4.92 IC17.2 | 54.61,3.64 48.89,3.64 48.26,4.28 | 48.26,4.28 46.98,5.55 CORE-IO.1 | 48.26,4.28 43.18,4.28 42.54,4.92 21.58,4.92 19.04,7.46 IC1.3 | v90.16,3.64 79.37,3.64 78.1,2.38 63.5,2.38 62.23,3.64 54.61,3.64
PIA-A1  (via drill 0.61)
  Top 0.254: IC7.4 61.59,62.7 60.32,63.97 60.32,70.32 61.59,71.59 61.59,72.86 IC8.4 | IC16.5 102.23,70.32 102.23,69.05 103.5,67.78 103.5,61.43 102.23,60.16 IC15.5 102.23,57.62 102.86,56.98 102.86,55.71 103.5,55.08 103.5,48.73 102.23,47.46 IC14.5 102.23,44.92 102.23,43.65 103.5,42.38 103.5,39.84 102.86,39.2 102.86,35.39 102.23,34.76 IC13.5 102.23,32.22 102.23,30.95 103.5,29.68 103.5,27.14 102.86,26.5 | IC11.5 102.23,9.36 103.5,10.63 103.5,16.98 102.23,18.25 102.23,19.52 IC12.5 102.23,22.06 102.86,22.7 102.86,26.5 | IC17.5 64.13,6.82 62.86,8.09 62.86,15.71 64.13,16.98 IC18.5 | 22.22,18.25 22.22,10.63 20.95,9.36 IC1.4 | 22.22,18.25 20.95,19.52 IC2.4 | 22.22,30.95 20.95,32.22 IC3.4 | 22.22,18.25 22.22,30.95 | 22.22,43.65 20.95,44.92 IC4.4 | 22.22,30.95 22.22,43.65 | 22.22,56.35 20.95,57.62 IC5.4 | 22.22,43.65 22.22,56.35 | 22.22,56.35 22.22,69.05 20.95,70.32 IC6.4 | v103.5,26.5 102.86,26.5
  Bottom 0.254: IC8.4 62.23,73.5 63.5,72.22 90.16,72.22 91.44,73.5 100.32,73.5 101.59,72.22 IC16.5 | IC1.4 21.58,7.46 23.49,5.55 43.18,5.55 CORE-IO.2 44.45,5.55 45.72,6.82 52.07,6.82 52.7,7.46 62.23,7.46 63.5,6.18 IC17.5 | v103.5,26.5 102.86,25.87 86.35,25.87 85.08,24.6 78.1,24.6 77.46,23.96 68.57,23.96 64.13,19.52 IC18.5
PIA-A2
  Top 0.254: IC7.7 69.21,62.7 67.94,63.97 67.94,71.59 69.21,72.86 IC8.7 | IC11.6 104.77,9.36 106.04,10.63 106.04,18.25 104.77,19.52 IC12.6 105.41,21.42 108.58,24.6 108.58,29.68 105.41,32.85 IC13.6 104.77,34.76 106.04,36.03 106.04,43.65 | 106.04,43.65 104.77,44.92 IC14.6 | 106.04,56.35 104.77,57.62 IC15.6 | 106.04,56.35 106.04,43.65 | 106.04,56.35 106.04,69.05 104.77,70.32 IC16.6 | IC17.6 66.67,6.82 65.4,8.09 65.4,14.44 66.67,15.71 66.67,16.98 IC18.6 | IC6.7 28.57,70.32 29.2,69.69 29.2,68.41 29.84,67.78 29.84,61.43 28.57,60.16 IC5.7 28.57,57.62 29.84,56.35 29.84,49.37 28.57,48.09 28.57,47.46 IC4.7 28.57,44.92 28.57,43.65 29.84,42.38 29.84,36.03 28.57,34.76 IC3.7 28.57,32.22 29.84,30.95 29.84,27.14 29.2,26.5 29.2,22.7 28.57,22.06 IC2.7 28.57,19.52 28.57,18.25 29.84,16.98 29.84,14.44 29.2,13.81 29.2,10 28.57,9.36 IC1.7 28.57,6.82 28.57,2.38 33.02,2.38 37.46,6.82 44.45,6.82 45.72,8.09 CORE-IO.3
  Bottom 0.254: 93.34,56.35 93.34,60.16 89.53,63.97 70.48,63.97 69.21,62.7 IC7.7 | 93.34,56.35 102.23,56.35 104.13,58.25 IC15.6 | CORE-IO.3 46.98,8.09 48.26,9.36 62.86,9.36 66.03,6.18 IC17.6 | 93.34,56.35 92.7,55.71 86.35,55.71 82.55,51.91 76.19,51.91 75.56,52.54 75.56,56.35 31.11,56.35 29.2,58.25 IC5.7
PIA-A3  (via drill 0.61)
  Top 0.254: IC11.9 112.39,9.36 113.66,10.63 113.66,16.98 112.39,18.25 112.39,19.52 IC12.9 112.39,22.06 113.02,22.7 113.02,26.5 113.66,27.14 113.66,29.68 112.39,30.95 112.39,32.22 IC13.9 112.39,34.76 113.02,35.39 113.02,39.2 113.66,39.84 113.66,43.65 | IC7.8 71.75,62.7 70.48,63.97 70.48,70.32 71.75,71.59 71.75,72.86 IC8.8 | 113.66,43.65 112.39,44.92 IC14.9 | 113.66,43.65 113.66,56.35 112.39,57.62 IC15.9 112.39,60.16 112.39,63.97 113.66,65.24 113.66,69.05 112.39,70.32 IC16.9 112.39,72.86 v112.39,74.77 | 32.38,30.95 32.38,23.33 31.11,22.06 IC2.8 31.11,19.52 32.38,18.25 32.38,14.44 31.74,13.81 31.74,8.73 IC1.8 | 32.38,30.95 31.11,32.22 IC3.8 | 32.38,30.95 32.38,43.65 31.11,44.92 IC4.8 31.11,47.46 32.38,48.73 32.38,56.35 | 32.38,56.35 31.11,57.62 IC5.8 | 32.38,56.35 32.38,69.05 31.11,70.32 IC6.8 | IC17.9 74.29,6.82 73.02,8.09 73.02,15.71 74.29,16.98 IC18.9
  Bottom 0.254: v112.39,74.77 100.32,74.77 99.05,76.03 73.66,76.03 72.38,74.77 IC8.8 | IC1.8 31.74,7.46 33.02,6.18 41.27,6.18 43.18,8.09 CORE-IO.4 44.45,8.09 45.72,9.36 46.98,9.36 47.62,10 64.77,10 65.4,9.36 70.48,9.36 72.38,7.46 | 72.38,7.46 73.66,6.18 IC17.9 | 72.38,7.46 77.46,7.46 78.1,6.82 85.08,6.82 85.72,7.46 85.72,8.73 88.89,11.9 90.8,11.9 90.8,6.82 91.44,6.18 103.5,6.18 103.5,9.36 104.13,10 110.48,10 111.75,8.73 IC11.9
PIA-A4  (via drill 0.61)
  Top 0.254: 111.12,25.87 111.12,18.25 112.39,16.98 IC11.12 | 111.12,25.87 112.39,27.14 IC12.12 | 111.12,25.87 111.12,34.76 111.75,35.39 111.75,39.2 112.39,39.84 IC13.12 112.39,42.38 112.39,43.65 111.12,44.92 111.12,56.35 | IC7.13 71.75,70.32 73.02,71.59 73.02,75.4 71.75,76.67 71.75,80.48 IC8.13 | 111.12,56.35 112.39,55.08 IC14.12 | 111.12,60.8 111.12,63.97 | 111.12,60.8 111.12,56.35 | 111.12,63.97 112.39,65.24 IC15.12 | 111.12,63.97 111.12,76.67 112.39,77.94 IC16.12 | v108.58,64.61 108.58,63.34 111.12,60.8 | IC18.12 73.66,26.5 72.38,27.77 70.48,27.77 70.48,24.6 71.75,23.33 71.75,20.79 70.48,19.52 70.48,16.98 67.94,14.44 67.94,4.28 68.57,3.64 75.56,3.64 75.56,6.82 74.29,8.09 74.29,11.9 IC17.12 | v30.47,11.9 31.11,12.54 31.11,14.44 IC1.13 31.11,16.98 29.84,18.25 29.84,25.87 31.11,27.14 IC2.13 31.11,29.68 30.47,30.31 30.47,31.58 29.84,32.22 29.84,34.76 31.11,36.03 31.11,39.84 IC3.13 31.11,42.38 29.84,43.65 29.84,48.09 31.11,49.37 31.11,52.54 IC4.13 31.11,55.08 31.11,56.35 29.84,57.62 29.84,60.16 30.47,60.8 30.47,64.61 31.11,65.24 IC5.13 31.11,67.78 29.84,69.05 29.84,74.13 31.11,75.4 31.11,77.94 IC6.13 31.11,80.48 31.11,88.1 75.56,88.1 78.73,84.92 78.73,71.59 v80.64,69.69
  Bottom 0.254: 80.64,64.61 v108.58,64.61 | 80.64,64.61 76.19,64.61 72.38,68.41 IC7.13 | IC17.12 73.66,13.81 72.38,15.08 66.03,15.08 65.4,14.44 65.4,10.63 46.98,10.63 CORE-IO.5 45.72,10.63 44.45,11.9 v30.47,11.9 | v80.64,69.69 80.64,64.61
PIA-A5  (via drill 0.61)
  Top 0.254: IC11.15 104.77,16.98 103.5,18.25 103.5,25.23 104.77,26.5 104.77,27.14 IC12.15 104.77,29.68 103.5,30.95 103.5,38.57 104.77,39.84 IC13.15 104.77,42.38 103.5,43.65 103.5,47.46 104.77,48.73 104.77,52.54 IC14.15 104.77,55.08 103.5,56.35 103.5,60.16 104.77,61.43 104.77,65.24 IC15.15 104.77,67.78 103.5,69.05 103.5,76.67 104.77,77.94 IC16.15 | IC7.14 69.21,70.32 70.48,71.59 70.48,79.21 69.21,80.48 IC8.14 | 27.3,51.27 27.3,43.65 28.57,42.38 IC3.14 28.57,39.84 27.3,38.57 27.3,31.58 28.57,30.31 28.57,29.68 IC2.14 28.57,27.14 28.57,23.33 27.3,22.06 27.3,18.25 | 27.3,51.27 28.57,52.54 IC4.14 | 27.3,63.97 28.57,65.24 IC5.14 | 27.3,51.27 27.3,63.97 | 27.3,63.97 27.3,76.67 28.57,77.94 IC6.14 | IC17.15 66.67,14.44 67.94,15.71 67.94,23.33 66.67,24.6 IC18.15 | 27.3,18.25 28.57,16.98 IC1.14 | 27.3,18.25 27.3,1.74 44.45,1.74 47.62,4.92 47.62,9.36 45.72,9.36 44.45,10.63 CORE-IO.6 | v47.62,75.4 40.64,75.4 v40.64,77.94
  Bottom 0.254: IC16.15 104.13,79.84 102.86,81.11 91.44,81.11 90.8,80.48 80.64,80.48 80,79.84 71.11,79.84 69.84,81.11 IC8.14 68.57,81.11 64.77,77.3 53.97,77.3 52.07,75.4 v47.62,75.4 | IC18.15 66.03,25.23 64.77,23.96 47.62,23.96 46.98,24.6 37.46,24.6 34.92,27.14 34.92,30.31 30.47,30.31 29.2,29.04 IC2.14 | v40.64,77.94 40,77.3 30.47,77.3 29.2,78.58 IC6.14
PIA-A6  (via drill 0.61)
  Top 0.254: v60.32,71.59 60.32,79.21 61.59,80.48 IC8.17 60.96,82.39 59.69,83.66 48.26,83.66 v48.26,82.39 | IC11.16 102.23,16.98 101.59,17.61 101.59,18.88 100.96,19.52 100.96,22.06 102.23,23.33 102.23,27.14 IC12.16 102.23,29.68 100.96,30.95 100.96,34.76 102.23,36.03 102.23,39.84 IC13.16 102.23,42.38 100.96,43.65 100.96,51.27 | 100.96,51.27 102.23,52.54 IC14.16 | 100.96,63.97 102.23,65.24 IC15.16 | 100.96,63.97 100.96,51.27 | 100.96,69.69 100.96,63.97 | 100.96,69.69 100.96,72.86 101.59,73.5 101.59,77.3 102.23,77.94 IC16.16 | v98.42,69.69 100.96,69.69 | IC17.16 64.13,14.44 65.4,15.71 65.4,23.33 64.13,24.6 IC18.16 | IC1.17 20.95,16.98 19.68,18.25 19.68,22.06 20.95,23.33 20.95,27.14 IC2.17 20.95,29.68 19.68,30.95 19.68,34.76 20.95,36.03 20.95,39.84 IC3.17 20.95,42.38 19.68,43.65 19.68,48.09 20.95,49.37 20.95,52.54 IC4.17 20.95,55.08 19.68,56.35 19.68,63.97 20.95,65.24 IC5.17 20.95,67.78 19.68,69.05 19.68,76.67 20.95,77.94 IC6.17 20.95,80.48 v20.95,84.29 | v40,14.44 44.45,14.44 45.72,13.17 CORE-IO.7
  Bottom 0.254: v60.32,71.59 61.59,70.32 IC7.17 62.23,69.69 63.5,70.95 90.16,70.95 91.44,69.69 v98.42,69.69 | CORE-IO.7 46.98,13.17 48.89,11.27 62.23,11.27 63.5,12.54 IC17.16 | v40,14.44 36.83,17.61 22.86,17.61 21.58,16.34 IC1.17 | v48.26,82.39 47.62,83.02 45.72,83.02 45.08,82.39 42.54,84.92 31.11,84.92 29.84,83.66 21.58,83.66 v20.95,84.29
PIA-A7  (via drill 0.61)
  Top 0.254: 17.14,25.87 17.14,18.25 18.41,16.98 IC1.18 18.41,14.44 17.77,13.81 v17.77,11.9 | 17.14,25.87 18.41,27.14 IC2.18 | 17.14,38.57 18.41,39.84 IC3.18 | 17.14,25.87 17.14,38.57 | 17.14,51.27 18.41,52.54 IC4.18 | 17.14,38.57 17.14,51.27 | 17.14,51.27 17.14,63.97 18.41,65.24 IC5.18 18.41,67.78 18.41,68.41 17.14,69.69 17.14,76.67 18.41,77.94 IC6.18 | 93.34,25.87 93.34,18.25 94.61,16.98 IC11.19 | 93.34,25.87 94.61,27.14 IC12.19 | 93.34,38.57 94.61,39.84 IC13.19 | 93.34,38.57 93.34,25.87 | 93.34,51.27 94.61,52.54 IC14.19 | 93.34,51.27 93.34,38.57 | 93.34,51.27 93.34,63.97 94.61,65.24 IC15.19 94.61,67.78 93.34,69.05 93.34,72.86 94.61,74.13 94.61,77.94 IC16.19 | IC17.19 56.51,14.44 55.24,15.71 55.24,23.33 56.51,24.6 IC18.19 56.51,27.14 56.51,29.68 59.05,32.22 59.05,58.89 60.32,60.16 60.32,62.7 59.05,63.97 59.05,67.78 IC7.18 | v57.78,76.03 57.78,79.21 59.05,80.48 IC8.18
  Bottom 0.254: IC17.19 55.88,13.81 54.61,15.08 53.34,15.08 52.7,14.44 45.72,14.44 44.45,13.17 CORE-IO.8 43.18,13.17 30.47,13.17 29.84,12.54 18.41,12.54 v17.77,11.9 | 60.32,76.03 60.32,76.67 92.07,76.67 93.97,78.58 IC16.19 | 60.32,76.03 60.32,72.86 59.69,72.22 59.05,72.22 59.05,70.32 IC7.18 | 60.32,76.03 v57.78,76.03
PIA-B0  (via drill 0.61)
  Top 0.254: IC9.1 64.13,34.76 62.86,36.03 62.86,43.65 64.13,44.92 IC10.1 | v48.26,25.87 48.26,23.33 46.35,21.42 CORE-IO.13
  Bottom 0.254: v48.26,25.87 54.61,32.22 64.13,32.22 IC9.1
PIA-B1  (via drill 0.61)
  Top 0.254: IC9.2 66.67,34.76 65.4,36.03 65.4,43.65 66.67,44.92 IC10.2 | v38.1,44.92 38.1,27.14 43.81,21.42 CORE-IO.14
  Bottom 0.254: v38.1,44.92 62.86,44.92 63.5,44.28 64.77,44.28 66.03,45.55 IC10.2
PIA-B2  (via drill 0.61)
  Top 0.254: IC10.3 69.21,44.92 70.48,43.65 70.48,36.03 69.21,34.76 IC9.3 68.57,32.85 68.57,31.58 63.5,31.58 v60.32,34.76 | v47.62,32.22 47.62,27.14 45.72,27.14 45.08,26.5 45.08,25.23 46.35,23.96 CORE-IO.15
  Bottom 0.254: v47.62,32.22 50.16,34.76 v60.32,34.76
PIA-B3
  Top 0.254: IC19.1 43.18,50.63 41.91,49.37 41.91,25.87 43.81,23.96 CORE-IO.16
PIA-B4  (via drill 0.61)
  Top 0.254: v48.89,34.76 48.89,48.73 45.08,48.73 IC19.2
  Bottom 0.254: v48.89,34.76 45.08,30.95 40.64,30.95 39.37,29.68 39.37,27.14 44.45,27.14 45.72,25.87 CORE-IO.17
PIA-B5
  Top 0.254: IC19.3 44.45,45.55 46.35,43.65 46.35,30.31 45.08,29.04 45.08,27.77 43.81,26.5 CORE-IO.18
PIA-B6  (via drill 0.61)
  Top 0.254: IC9.4 72.38,32.85 73.66,31.58 75.56,31.58 75.56,43.65 76.83,44.92 IC10.6 | v40.64,29.68 39.37,30.95 v39.37,42.38
  Bottom 0.254: v40.64,29.68 44.45,29.68 45.72,28.41 CORE-IO.19 | v39.37,42.38 62.86,42.38 63.5,43.02 73.66,43.02 76.19,45.55 IC10.6
PIA-B7
  Top 0.254: IC19.5 44.45,40.48 45.72,39.2 45.72,30.95 43.81,29.04 CORE-IO.20
  Bottom 0.254: DEVSEL.2 54.61,33.49 48.26,27.14 45.72,27.14 44.45,28.41 CORE-IO.20
VCC  (via drill 0.61)
  Top 0.508: CORE-IO.9 45.72,15.71 43.81,17.61 CORE-IO.12 | v51.43,15.71 51.43,13.81 BYP18.1 | v53.97,20.79 53.97,24.6 IC18.20 | BYP6.1 11.43,79.21 12.7,79.21 IC6.20 13.33,77.94 13.33,74.77 11.43,72.86 11.43,67.78 10.79,67.14 BYP5.1 10.79,65.88 11.43,65.24 11.43,62.7 12.06,62.06 12.06,53.81 | IC1.20 13.33,16.98 14.6,18.25 14.6,25.87 13.33,27.14 IC2.20 13.33,29.68 14.6,30.95 14.6,38.57 13.33,39.84 IC3.20 | 12.06,53.81 12.7,53.81 IC4.20 13.33,52.54 12.06,51.27 12.06,43.65 10.79,42.38 10.79,41.74 BYP3.1 | 12.06,53.81 11.43,53.81 BYP4.1 | v36.19,23.96 34.92,25.23 v34.92,38.57 34.92,42.38 32.38,44.92 32.38,47.46 v33.65,48.73 | BYP7.1 52.07,69.05 53.34,69.05 IC7.20 | 52.7,81.75 53.34,81.75 IC8.20 | 52.7,81.75 52.07,81.75 BYP8.1 | 52.7,81.75 52.7,71.59 53.97,70.32 IC7.20 | BYP17.1 50.16,53.17 50.16,52.54 50.8,51.91 IC19.16 52.7,51.27 52.7,66.51 53.97,67.78 IC7.20 | BYP10.1 62.23,53.81 63.5,53.81 IC10.16 | BYP9.1 61.59,41.74 62.23,42.38 62.23,46.82 64.13,48.73 64.13,52.54 IC10.16 | BYP16.1 90.16,79.21 91.44,79.21 IC16.20 92.07,77.94 90.8,76.67 90.8,66.51 | 90.8,66.51 91.44,66.51 IC15.20 92.07,65.24 92.07,62.06 90.16,60.16 90.16,55.08 89.53,54.45 BYP14.1 | 90.8,66.51 90.16,66.51 BYP15.1 | IC18.11 76.83,27.14 76.83,32.22 IC9.6 76.83,34.76 78.1,36.03 78.1,42.38 | 83.18,60.8 81.91,59.52 BYP20.1 | 83.18,60.8 84.45,62.06 v84.45,79.21 84.45,80.48 83.18,81.75 JP2.2 | 78.1,42.38 80.64,44.92 80.64,50 83.18,52.54 83.18,60.8 | 78.1,42.38 78.1,47.46 77.46,48.09 72.38,48.09 67.94,52.54 67.94,55.71 66.03,55.71 64.77,54.45 IC10.16 | BYP13.1 90.16,41.11 91.44,41.11 IC13.20 92.07,39.84 90.8,38.57 90.8,28.41
  Top 0.508: 90.8,28.41 91.44,28.41 IC12.20 92.07,27.14 90.8,25.87 90.8,15.71 | 90.8,28.41 90.16,28.41 BYP12.1 | 90.8,15.71 90.16,15.71 BYP11.1 | 90.8,15.71 91.44,15.71 IC11.20 | IC11.11 114.93,16.98 113.66,18.25 113.66,25.87 114.93,27.14 IC12.11 114.93,29.68 113.66,30.95 113.66,38.57 114.93,39.84 IC13.11 114.93,42.38 116.2,43.65 116.2,51.27 114.93,52.54 IC14.11 114.93,55.08 114.93,56.35 113.66,57.62 113.66,63.97 114.93,65.24 IC15.11 114.93,67.78 114.93,69.05 113.66,70.32 113.66,76.67 114.93,77.94 IC16.11
  Bottom 0.508: BYP19.1 52.07,25.87 53.34,25.87 IC18.20 | BYP18.1 52.07,13.17 53.34,13.17 IC17.20 | 48.89,15.71 46.98,15.71 CORE-IO.9 | 48.89,15.71 v51.43,15.71 | 48.89,15.71 v53.97,20.79 | BYP5.1 11.43,66.51 12.7,66.51 IC5.20 | BYP1.1 11.43,15.71 12.7,15.71 IC1.20 | BYP2.1 11.43,28.41 12.7,28.41 IC2.20 | BYP3.1 11.43,41.11 12.7,41.11 IC3.20 13.33,42.38 4.44,42.38 4.44,40.48 5.08,39.84 6.34,39.84 7.62,38.57 v34.92,38.57 42.54,38.57 IC19.6 | v36.19,23.96 37.46,23.96 43.18,18.25 CORE-IO.12 | BYP9.1 62.23,41.11 63.5,41.11 IC9.16 | IC10.16 64.13,52.54 53.97,52.54 52.7,51.27 IC19.16 50.16,51.27 48.89,50 34.92,50 v33.65,48.73 | BYP14.1 90.16,53.81 91.44,53.81 IC14.20 | v84.45,79.21 88.89,79.21 BYP16.1 | IC17.11 77.46,13.81 78.1,14.44 87.62,14.44 88.89,15.71 BYP11.1 | IC11.20 92.7,15.08 93.97,13.81 113.02,13.81 114.3,15.08 IC11.11 | JP2.2 83.18,81.75 107.31,81.75 108.58,80.48 108.58,77.94 109.21,77.3 113.02,77.3 114.3,78.58 IC16.11

## Text on the board
Top: PA8PDP/VRS | Component Side
Bottom: Solder Side
tValues: RealConsole I/O - Rev.2 | + | - | - | +